# Altium schematic sheet IR_SENSOR.SchDoc
size A4
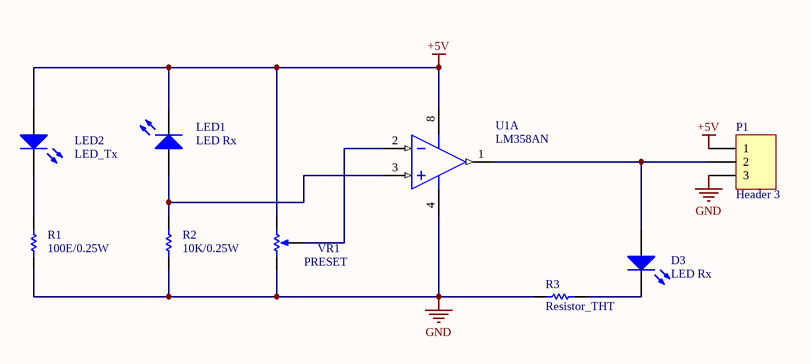
[diagram p0: IR_SENSOR.SchDoc]

## Parts
D3  LED Rx  [LED-1]
LED1  LED Rx  [LED-1]
LED2  LED_Tx  [LED-1]
P1  Header 3  [HDR1X3]
R1  value 100E/0.25W  [AXIAL-0.3]  (hidden comment: 8-Jun-2000)
R2  value 10K/0.25W  [AXIAL-0.3]  (hidden comment: Res1)
R3  Resistor_THT  [AXIAL-0.3]
U1  LM358AN  [N08E]  (part A of 2)
VR1  VR1  value PRESET  [VR5]

## Nets
+5V: LED1.2(K) LED2.1(A) P1.1 U1.8(V+) VR1.2(BOT)
GND: P1.3 R1.1 R2.1 R3.2 U1.4(GND) VR1.1(TOP)
NetD3_1: D3.1(A) P1.2 U1.1(OUTA)
NetD3_2: D3.2(K) R3.1
NetLED1_1: LED1.1(A) R2.2 U1.3(INA+)
NetLED2_2: LED2.2(K) R1.2
NetU1_2: U1.2(INA-) VR1.3(TAP)

## Library data of the parts
D3 LED1 LED2 = LED1: Typical RED GaAs LED; Published: 8-Jun-2000; LatestRevisionDate: 08-Jul-2005; LatestRevisionNote: Mech Layer 1 removed.; PackageReference: LED-1; Publisher: Altium Limited
P1 = Header 3: Header, 3-Pin; LatestRevisionDate: 17-Jul-2002; LatestRevisionNote: Re-released for DXP Platform.; Publisher: Altium Limited
R1 R2 = Res1: Resistor; Published: 8-Jun-2000; LatestRevisionDate: 17-Jul-2002; LatestRevisionNote: Re-released for DXP Platform.; PackageReference: AXIAL-0.3; Publisher: Altium Limited
R3 = Res1: Resistor; Value: 1K; Published: 8-Jun-2000; LatestRevisionDate: 17-Jul-2002; LatestRevisionNote: Re-released for DXP Platform.; PackageReference: AXIAL-0.3; Publisher: Altium Limited
U1 = LM358AN: Low Power Dual Operational Amplifier; Manufacturer: National Semiconductor; CompType: Amplifiers; PackageTopMarking: NSUZXYTT*LM*358AN; PowerWise: N; Published: 4-Dec-2008; LatestRevisionDate: 13-Jan-2009; LatestRevisionNote: Sim Model Added.; DatasheetVersion: Oct-2005; PackageVersion: revG, May-2006; PackageReference: N08E; Publisher: Altium Limited; PackageDescription: MDIP, .365 x .250 x .130in, 8 Lead, .100in Pitch; PartNumber: LM358AN; RoHS: O; PinCount: 8; DigiKeyPartNumber: LM358ANNS-ND; Code_JEDEC: MS-001-BA; ComponentLink1Description: LM358 Datasheet; ComponentLink1URL: http://www.national.com/ds/LM/LM358.pdf; ComponentLink2Description: LM358 Web Page; ComponentLink2URL: http://www.national.com/pf/LM/LM358.html; ComponentLink3Description: N08E Package Page; ComponentLink3URL: http://www.national.com/packaging/folders/n08e.html
VR1 = RPot: Potentiometer; Sim Note: Enter the Resistance value and the set point into parameter fields.; Set Position: 0.5; Published: 8-Jun-2000; LatestRevisionDate: 17-Jul-2002; LatestRevisionNote: Re-released for DXP Platform.; PackageReference: VR5; Publisher: Altium Limited